# EAGLE design I2C Short Link (EAGLE 9.6.1)
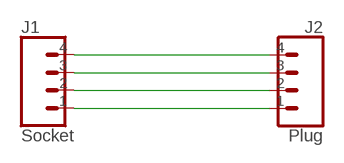
[diagram p0: schematic, sheet 1]

## Parts
J1  Socket  HEADER-1X4-GENERIC  [CONN_04-GENERIC]
J2  Plug  HEADER-1X4-GENERIC  [CONN_04-GENERIC]

## Nets
N$1: J1.4 J2.4
N$2: J1.3 J2.3
N$3: J1.2 J2.2
N$4: J1.1 J2.1

## Library data of the parts
J1 J2 = digitalconcepts:HEADER-1X4-GENERIC: Single Row 4-Pin Header

## Board
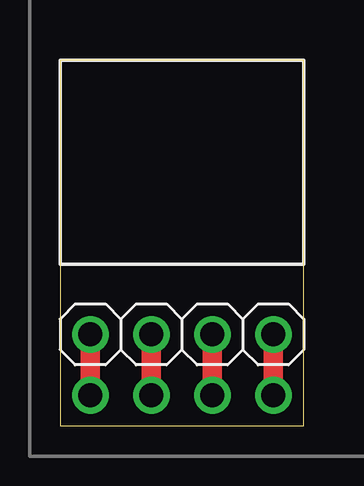
[diagram p1: board, top side]
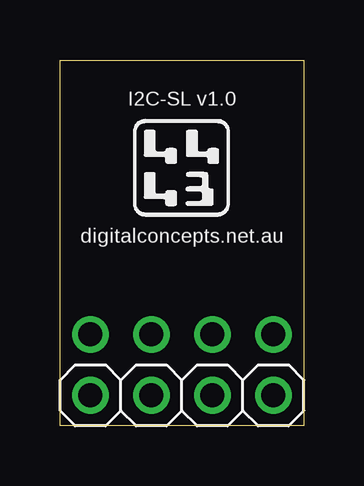
[diagram p2: board, bottom side, seen from below]

Size 10.16 x 15.24 mm. Coordinates in mm from the lower left corner, seen from the top.
Outline: 0,0 10.16,0 10.16,15.24 0,15.24 0,0
Copper layers (1*16): Top 0.035mm / dielectric 1.5mm / Bottom 0.035mm
Design rules "default *": minimum track width 6mil, minimum drill 0.35mm, track to track 6mil, track to pad 6mil, pad to pad 6mil, via to via 6mil, smd to smd 6mil, copper to edge 15mil, drill to drill 6mil, minimum pad ring 10mil, minimum via ring 8mil, stop-mask expansion 4mil, vias tented up to drill 0mil, thermal gap 10mil

### Footprints (pad centres in the part's own frame; a part is rotated, then mirrored left to right if it is on the bottom)
CONN_04-GENERIC = drill 1 pad 1.524: 1 0,0; 2 2.54,0; 3 5.08,0; 4 7.62,0

### Placement (x,y rotation side)
J1  1.27,1.27 180 bottom
J2  1.27,3.81 0 top

### Tracks (layer width: path | path; a pad name or v marks a point on that pad's centre or on a via)
N$1
  Top 0.813: J2.4 J1.4
N$2
  Top 0.813: J2.3 J1.3
N$3
  Top 0.813: J2.2 J1.2
N$4
  Top 0.813: J2.1 J1.1

### Text on the board
bPlace: I2C-SL v1.0 | digitalconcepts.net.au